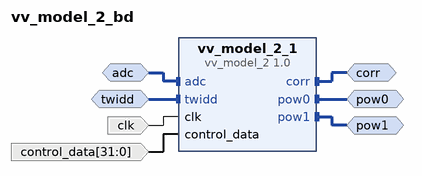
[diagram p0: block diagram of the top level]
# Vivado block design vv_model_2_bd, xc7z010clg400-1, Vivado 2019.1.1
create_bd_design vv_model_2_bd

create_bd_intf_port -mode Slave -vlnv xilinx.com:interface:axis_rtl:1.0 adc
set_property -dict [list \
  CONFIG.HAS_TKEEP 0 \
  CONFIG.HAS_TLAST 0 \
  CONFIG.HAS_TREADY 1 \
  CONFIG.HAS_TSTRB 0 \
  CONFIG.LAYERED_METADATA {xilinx.com:interface:datatypes:1.0 {TDATA {datatype {name {attribs {resolve_type immediate dependency {} format string minimum {} maximum {}} value {}} bitwidth {attribs {resolve_type immediate dependency {} format long minimum {} maximum {}} value 32} bitoffset {attribs {resolve_type immediate dependency {} format long minimum {} maximum {}} value 0} real {fixed {fractwidth {attribs {resolve_type immediate dependency {} format long minimum {} maximum {}} value 0} signed {attribs {resolve_type immediate dependency {} format bool minimum {} maximum {}} value false}}}}}}} \
  CONFIG.TDATA_NUM_BYTES 4 \
  CONFIG.TDEST_WIDTH 0 \
  CONFIG.TID_WIDTH 0 \
  CONFIG.TUSER_WIDTH 0 \
] [get_bd_intf_ports adc]
create_bd_intf_port -mode Master -vlnv xilinx.com:interface:axis_rtl:1.0 corr
create_bd_intf_port -mode Master -vlnv xilinx.com:interface:axis_rtl:1.0 pow0
create_bd_intf_port -mode Master -vlnv xilinx.com:interface:axis_rtl:1.0 pow1
create_bd_intf_port -mode Slave -vlnv xilinx.com:interface:axis_rtl:1.0 twidd
set_property -dict [list \
  CONFIG.HAS_TKEEP 0 \
  CONFIG.HAS_TLAST 0 \
  CONFIG.HAS_TREADY 1 \
  CONFIG.HAS_TSTRB 0 \
  CONFIG.LAYERED_METADATA {xilinx.com:interface:datatypes:1.0 {TDATA {datatype {name {attribs {resolve_type immediate dependency {} format string minimum {} maximum {}} value {}} bitwidth {attribs {resolve_type immediate dependency {} format long minimum {} maximum {}} value 32} bitoffset {attribs {resolve_type immediate dependency {} format long minimum {} maximum {}} value 0} real {fixed {fractwidth {attribs {resolve_type immediate dependency {} format long minimum {} maximum {}} value 0} signed {attribs {resolve_type immediate dependency {} format bool minimum {} maximum {}} value false}}}}}}} \
  CONFIG.TDATA_NUM_BYTES 4 \
  CONFIG.TDEST_WIDTH 0 \
  CONFIG.TID_WIDTH 0 \
  CONFIG.TUSER_WIDTH 0 \
] [get_bd_intf_ports twidd]
create_bd_port -dir I -type clk clk
create_bd_port -dir I -from 31 -to 0 -type data control_data

create_bd_cell -type ip -vlnv User_Company:SysGen:vv_model_2:1.0 vv_model_2_1

# ---- connections ----

connect_bd_intf_net [get_bd_intf_ports adc] [get_bd_intf_pins vv_model_2_1/adc]
connect_bd_intf_net [get_bd_intf_ports corr] [get_bd_intf_pins vv_model_2_1/corr]
connect_bd_intf_net [get_bd_intf_ports pow0] [get_bd_intf_pins vv_model_2_1/pow0]
connect_bd_intf_net [get_bd_intf_ports pow1] [get_bd_intf_pins vv_model_2_1/pow1]
connect_bd_intf_net [get_bd_intf_ports twidd] [get_bd_intf_pins vv_model_2_1/twidd]
connect_bd_net [get_bd_ports clk] [get_bd_pins vv_model_2_1/clk]
connect_bd_net [get_bd_ports control_data] [get_bd_pins vv_model_2_1/control_data]

validate_bd_design
save_bd_design
